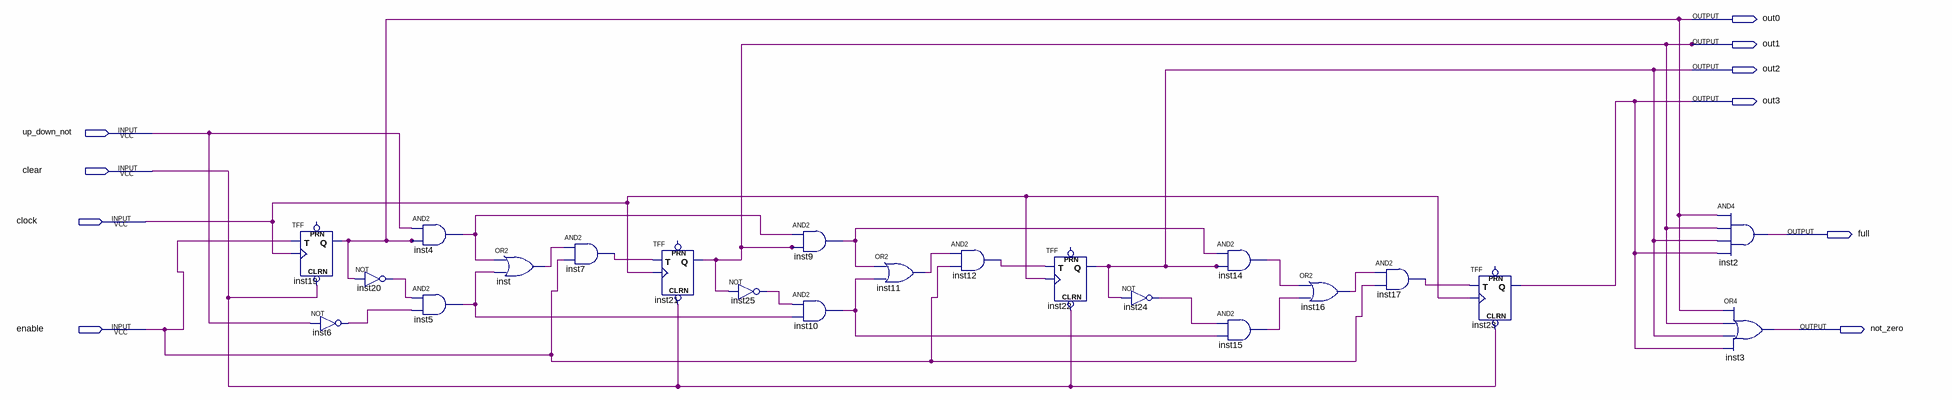
[diagram p0: schematic sheet]
// Quartus schematic Counter.bdf as structural Verilog: 22 symbols, 10 pins
module Counter (
  input  up_down_not,
  input  clear,
  input  clock,
  input  enable,
  output out0,
  output out1,
  output out2,
  output out3,
  output full,
  output not_zero
);

  wire inst4_out, inst5_out, inst6_out, inst7_out, inst9_out, inst10_out, inst11_out, inst12_out, inst14_out,
       inst15_out, inst16_out, inst17_out, inst20_out, inst24_out, inst25_out, inst_out;

  TFF inst19 (.CLRN(clear), .T(enable), .CLK(clock), .Q(out0));  // open: PRN
  not inst6 (inst6_out, up_down_not);
  not inst20 (inst20_out, out0);
  and inst4 (inst4_out, up_down_not, out0);
  and inst5 (inst5_out, inst20_out, inst6_out);
  or inst (inst_out, inst4_out, inst5_out);
  and inst7 (inst7_out, inst_out, enable);
  TFF inst21 (.CLRN(clear), .T(inst7_out), .CLK(clock), .Q(out1));  // open: PRN
  not inst25 (inst25_out, out1);
  and inst9 (inst9_out, inst4_out, out1);
  and inst10 (inst10_out, inst25_out, inst5_out);
  or inst11 (inst11_out, inst9_out, inst10_out);
  and inst12 (inst12_out, inst11_out, enable);
  TFF inst22 (.CLRN(clear), .T(inst12_out), .CLK(clock), .Q(out2));  // open: PRN
  not inst24 (inst24_out, out2);
  and inst14 (inst14_out, inst9_out, out2);
  and inst15 (inst15_out, inst24_out, inst10_out);
  or inst16 (inst16_out, inst14_out, inst15_out);
  and inst17 (inst17_out, inst16_out, enable);
  TFF inst23 (.CLRN(clear), .T(inst17_out), .CLK(clock), .Q(out3));  // open: PRN
  and inst2 (full, out0, out1, out2, out3);
  or inst3 (not_zero, out0, out1, out2, out3);
endmodule
